# EAGLE design microcc (EAGLE 6.1)
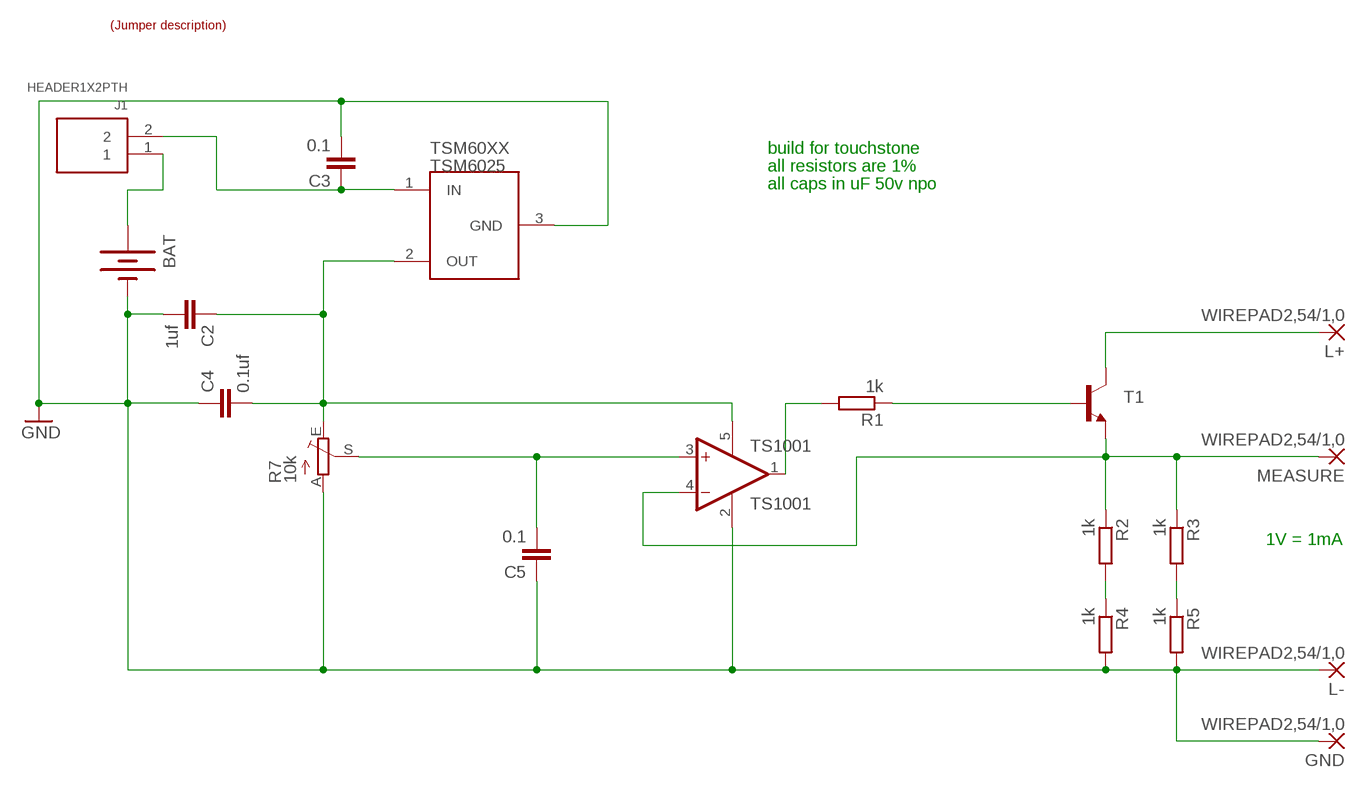
[diagram p0: schematic, sheet 1]

## Parts
BAT  BATTERY20SMD  [BATTCON_20MM]
C2  1uf  CAPC603  [C603]
C3  0.1  CAPC603  [C603]
C4  0.1uf  CAPC603  [C603]
C5  0.1  CAPC603  [C603]
GND  WIREPAD2,54/1,0  [2,54/1,0]
J1  HEADER1X2PTH  [M1X2]
L+  WIREPAD2,54/1,0  [2,54/1,0]
L-  WIREPAD2,54/1,0  [2,54/1,0]
MEASURE  WIREPAD2,54/1,0  [2,54/1,0]
R1  1k  RESISTORR603  [R603]
R2  1k  RESISTORR603  [R603]
R3  1k  RESISTORR603  [R603]
R4  1k  RESISTORR603  [R603]
R5  1k  RESISTORR603  [R603]
R7  10k  TRIM_EU-PTSPIN  [PT-SPIN]
T1  TRANSISTOR_NPNSOT23  [SOT23]
TS1001  TS1001  [SC70-5L]
TSM6025  TSM60XX  [SOT23]
U$1  JUMP2_DESC  [JUMP2_DESC]

## Nets
GND: BAT.2(-) C2.2 C3.2 C4.1 C5.1 GND.1(P) L-.1(P) R4.2 R5.2 R7.A TS1001.2(V-) TSM6025.3(GND)
N$1: R1.1 T1.1(B)
N$2: R2.2 R4.1
N$3: R1.2 TS1001.1(OUT)
N$4: C2.1 C4.2 R7.E TS1001.5(V+) TSM6025.2(OUT)
N$5: C3.1 J1.2 TSM6025.1(IN)
N$6: R3.2 R5.1
N$7: BAT.1(+) J1.1
N$9: C5.2 R7.S TS1001.3(+IN)
N$10: L+.1(P) T1.3(C)
N$11: MEASURE.1(P) R2.1 R3.1 T1.2(E) TS1001.4(-IN)

## Notes on the sheet
- build for touchstone
- all resistors are 1%
- all caps in uF 50v npo
- 1V = 1mA

## Library data of the parts
BAT = SparkFun:BATTERY: Battery Holders Various common sizes : AA, AAA, 20mm coin cell and 12mm coin cell.
C2-C5 = dp_devices:CAP
GND L+ L- MEASURE = wirepad:WIREPAD: Wire PAD connect wire on PCB
J1 = dp_devices:HEADER1X2
R1-R5 = dp_devices:RESISTOR
R7 = pot:TRIM_EU-: POTENTIOMETER
T1 = SparkFun:TRANSISTOR_NPN: Transistor NPN BJT configuration in SOT23 package. MMBT2222 is the common NPN we use. Double check BCE configuration again layout.
TS1001 = custom:TS1001: ts1001 lowpower rail to rail opamp sc70
TSM6025 = custom:TSM60XX
U$1 = dp_devices:JUMP2_DESC: Nice formatted two legged jumperdescription Use attributes to change the values ON = With jumper OFF = Without jumper; OFF: off; ON: on

## Board
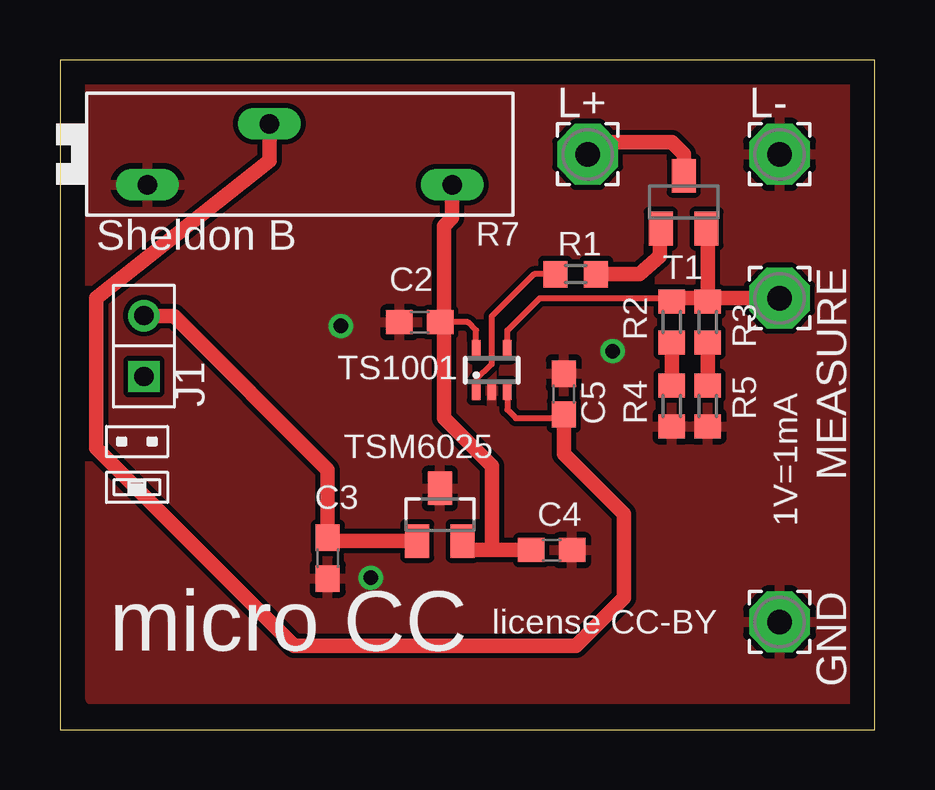
[diagram p1: board, top side]
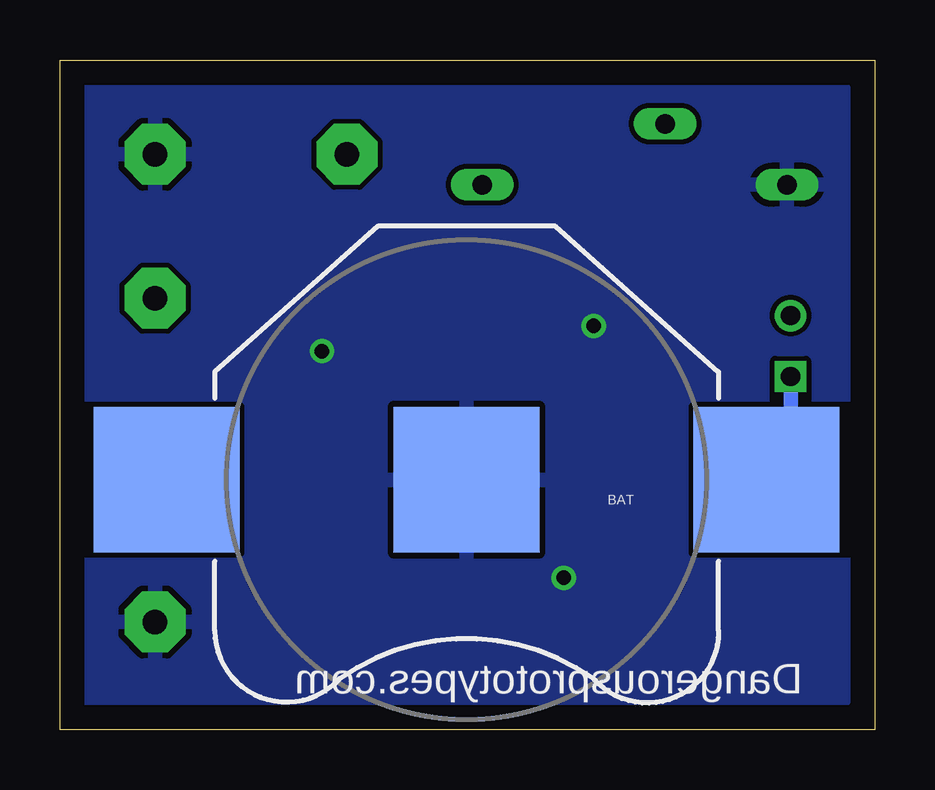
[diagram p2: board, bottom side, seen from below]

Size 33.96 x 27.93 mm. Coordinates in mm from the lower left corner, seen from the top.
Outline: 0,0 33.96,0 33.96,27.93 0,27.93 0,0
Copper layers (1*16): Top 0.035mm / dielectric 1.5mm / Bottom 0.035mm
Design rules: minimum track width 10mil, minimum drill 24mil, track to track 8mil, track to pad 8mil, pad to pad 8mil, via to via 8mil, smd to smd 8mil, copper to edge 40mil, drill to drill 8mil, minimum pad ring 10mil, minimum via ring 8mil, stop-mask expansion 4mil, vias tented up to drill 0mil, thermal gap 10mil

### Footprints (pad centres in the part's own frame; a part is rotated, then mirrored left to right if it is on the bottom)
BATTCON_20MM = smd 6.07 x 6.07: 1 -12.5,0; 2 0,0; 3 12.5,0
C603 = smd 1.1 x 1: 1 -0.85,0; 2 0.85,0
2,54/1,0 = drill 1.016 pad 2.54 octagon: 1 0,0
M1X2 = drill 0.8 square: 1 -1.27,0 | drill 0.8: 2 1.27,0
R603 = smd 1 x 1.1: 1 -0.85,0; 2 0.85,0
PT-SPIN = drill 0.813 long: A -6.35,-1.27; E 6.35,-1.27; S -1.27,1.27
SOT23 = smd 1 x 1.4: 1 -0.95,-1.1; 2 0.95,-1.1; 3 0,1.1
SC70-5L = smd 0.35 x 0.8: 1 -0.65,-0.85; 2 0,-0.85; 3 0.65,-0.85; 4 0.65,0.85; 5 -0.65,0.85

### Placement (x,y rotation side)
BAT  17.01,10.43 180 bottom
C2  15,17 180 top
C3  11.16,7.16 270 top
C4  20.5,7.5 180 top
C5  21,14 270 top
GND  30,4.5 270 top
J1  3.5,16 90 top
L+  22,24 0 top
L-  30,24 0 top
MEASURE  30,18 270 top
R1  21.5,19 180 top
R2  25.5,17 270 top
R3  27,17 270 top
R4  25.5,13.5 270 top
R5  27,13.5 270 top
R7  10,24 0 top
T1  26,22 0 top
TS1001  18,15 0 top
TSM6025  15.84,8.97 0 top
U$1  5.75,10.75 0 top

### Tracks (layer width: path | path; a pad name or v marks a point on that pad's centre or on a via)
GND  (via drill 0.6)
  other vias: 23.04,15.79 12.96,6.34 11.71,16.84
  pour Top: 1.27,26.94 33.02,26.94 33.02,1.27 1.27,1.27
  pour Bottom: 1.27,26.67 33.02,26.67 33.02,1.27 1.27,1.27
N$1
  Top 0.61: T1.1 25,20.85 25,19.75 24.15,19 R1.1
N$2
  Top 0.61: R4.1 R2.2
N$3
  Top 0.254: TS1001.1 17.35,14.6 18,15.25 18,17.25 19.75,19 R1.2
N$4
  Top 0.254: TS1001.5 17.35,16.65 17,17 16,17 C2.1
  Top 0.61: 18,7.5 C4.2 | TSM6025.2 17.16,7.5 18,7.5 | 18,7.5 18,11 16,13 16,16.6 C2.1 | R7.E 16.35,21.35 16,21 16,17
N$5
  Top 0.61: TSM6025.1 11.3,7.87 C3.1 11.16,10.84 4.75,17.25 3.25,17.25 J1.2
N$6
  Top 0.61: R3.2 R5.1
N$7
  Bottom 0.61: J1.1 3.5,12.25 3.5,11.75 3.5,11.44 BAT.1
N$9
  Top 0.254: TS1001.3 18.65,13.35 19,13 21,13 C5.2
  Top 0.61: R7.S 8.73,23.73 1.5,18 1.5,11.75 9.75,3.5 21.5,3.5 23.5,5.5 23.5,9 21,11.5 21,13
N$10
  Top 0.61: T1.3 26,24 25.5,24.5 22.25,24.5 22.25,24.25 L+.1
N$11
  Top 0.254: TS1001.4 18.65,16.65 20,18 25.25,18 | 25.25,18 25.5,18 | 25.5,18 R2.1 25.5,18 | 25.25,18 25.5,18
  Top 0.61: T1.2 27,20.85 27,18 | 27,18 MEASURE.1 | 27,18 25.25,18 25.25,17.75 | 27,18 R3.1

### Text on the board
_tsilk: Sheldon B | 1V=1mA | license CC-BY | micro CC
_bsilk: Dangerousprototypes.com